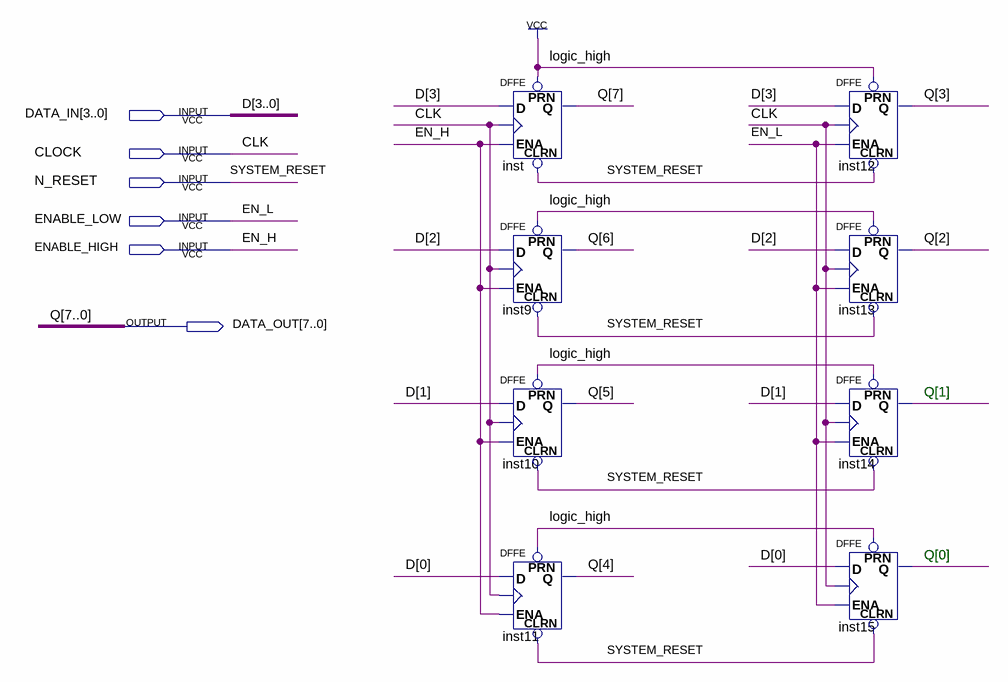
[diagram p0: schematic sheet]
// Quartus schematic data_path.bdf as structural Verilog: 8 symbols, 6 pins
module data_path (
  input  [3:0] DATA_IN,
  input  CLOCK,
  input  N_RESET,
  input  ENABLE_LOW,
  input  ENABLE_HIGH,
  output [7:0] DATA_OUT
);

  DFFE inst (.PRN(1'b1), .CLRN(N_RESET), .D(DATA_IN[3]), .CLK(CLOCK), .ENA(ENABLE_HIGH), .Q(DATA_OUT[7]));
  DFFE inst9 (.PRN(1'b1), .CLRN(N_RESET), .D(DATA_IN[2]), .CLK(CLOCK), .ENA(ENABLE_HIGH), .Q(DATA_OUT[6]));
  DFFE inst10 (.PRN(1'b1), .CLRN(N_RESET), .D(DATA_IN[1]), .CLK(CLOCK), .ENA(ENABLE_HIGH), .Q(DATA_OUT[5]));
  DFFE inst11 (.PRN(1'b1), .CLRN(N_RESET), .D(DATA_IN[0]), .CLK(CLOCK), .ENA(ENABLE_HIGH), .Q(DATA_OUT[4]));
  DFFE inst12 (.PRN(1'b1), .CLRN(N_RESET), .D(DATA_IN[3]), .CLK(CLOCK), .ENA(ENABLE_LOW), .Q(DATA_OUT[3]));
  DFFE inst13 (.PRN(1'b1), .CLRN(N_RESET), .D(DATA_IN[2]), .CLK(CLOCK), .ENA(ENABLE_LOW), .Q(DATA_OUT[2]));
  DFFE inst14 (.PRN(1'b1), .CLRN(N_RESET), .D(DATA_IN[1]), .CLK(CLOCK), .ENA(ENABLE_LOW), .Q(DATA_OUT[1]));
  DFFE inst15 (.PRN(1'b1), .CLRN(N_RESET), .D(DATA_IN[0]), .CLK(CLOCK), .ENA(ENABLE_LOW), .Q(DATA_OUT[0]));

  // Other names for the same wires on the sheet: CLK = CLOCK; D[3:0] = DATA_IN; EN_H = ENABLE_HIGH; EN_L = ENABLE_LOW;
  //   Q[7:0] = DATA_OUT; SYSTEM_RESET = N_RESET

  // Notes on the sheet:
  //   Q[1]
  //   Q[0]
endmodule
